# Altium schematic sheet SoC_PWR.SchDoc
size A3; SheetNumber: 3; SheetTotal: 6
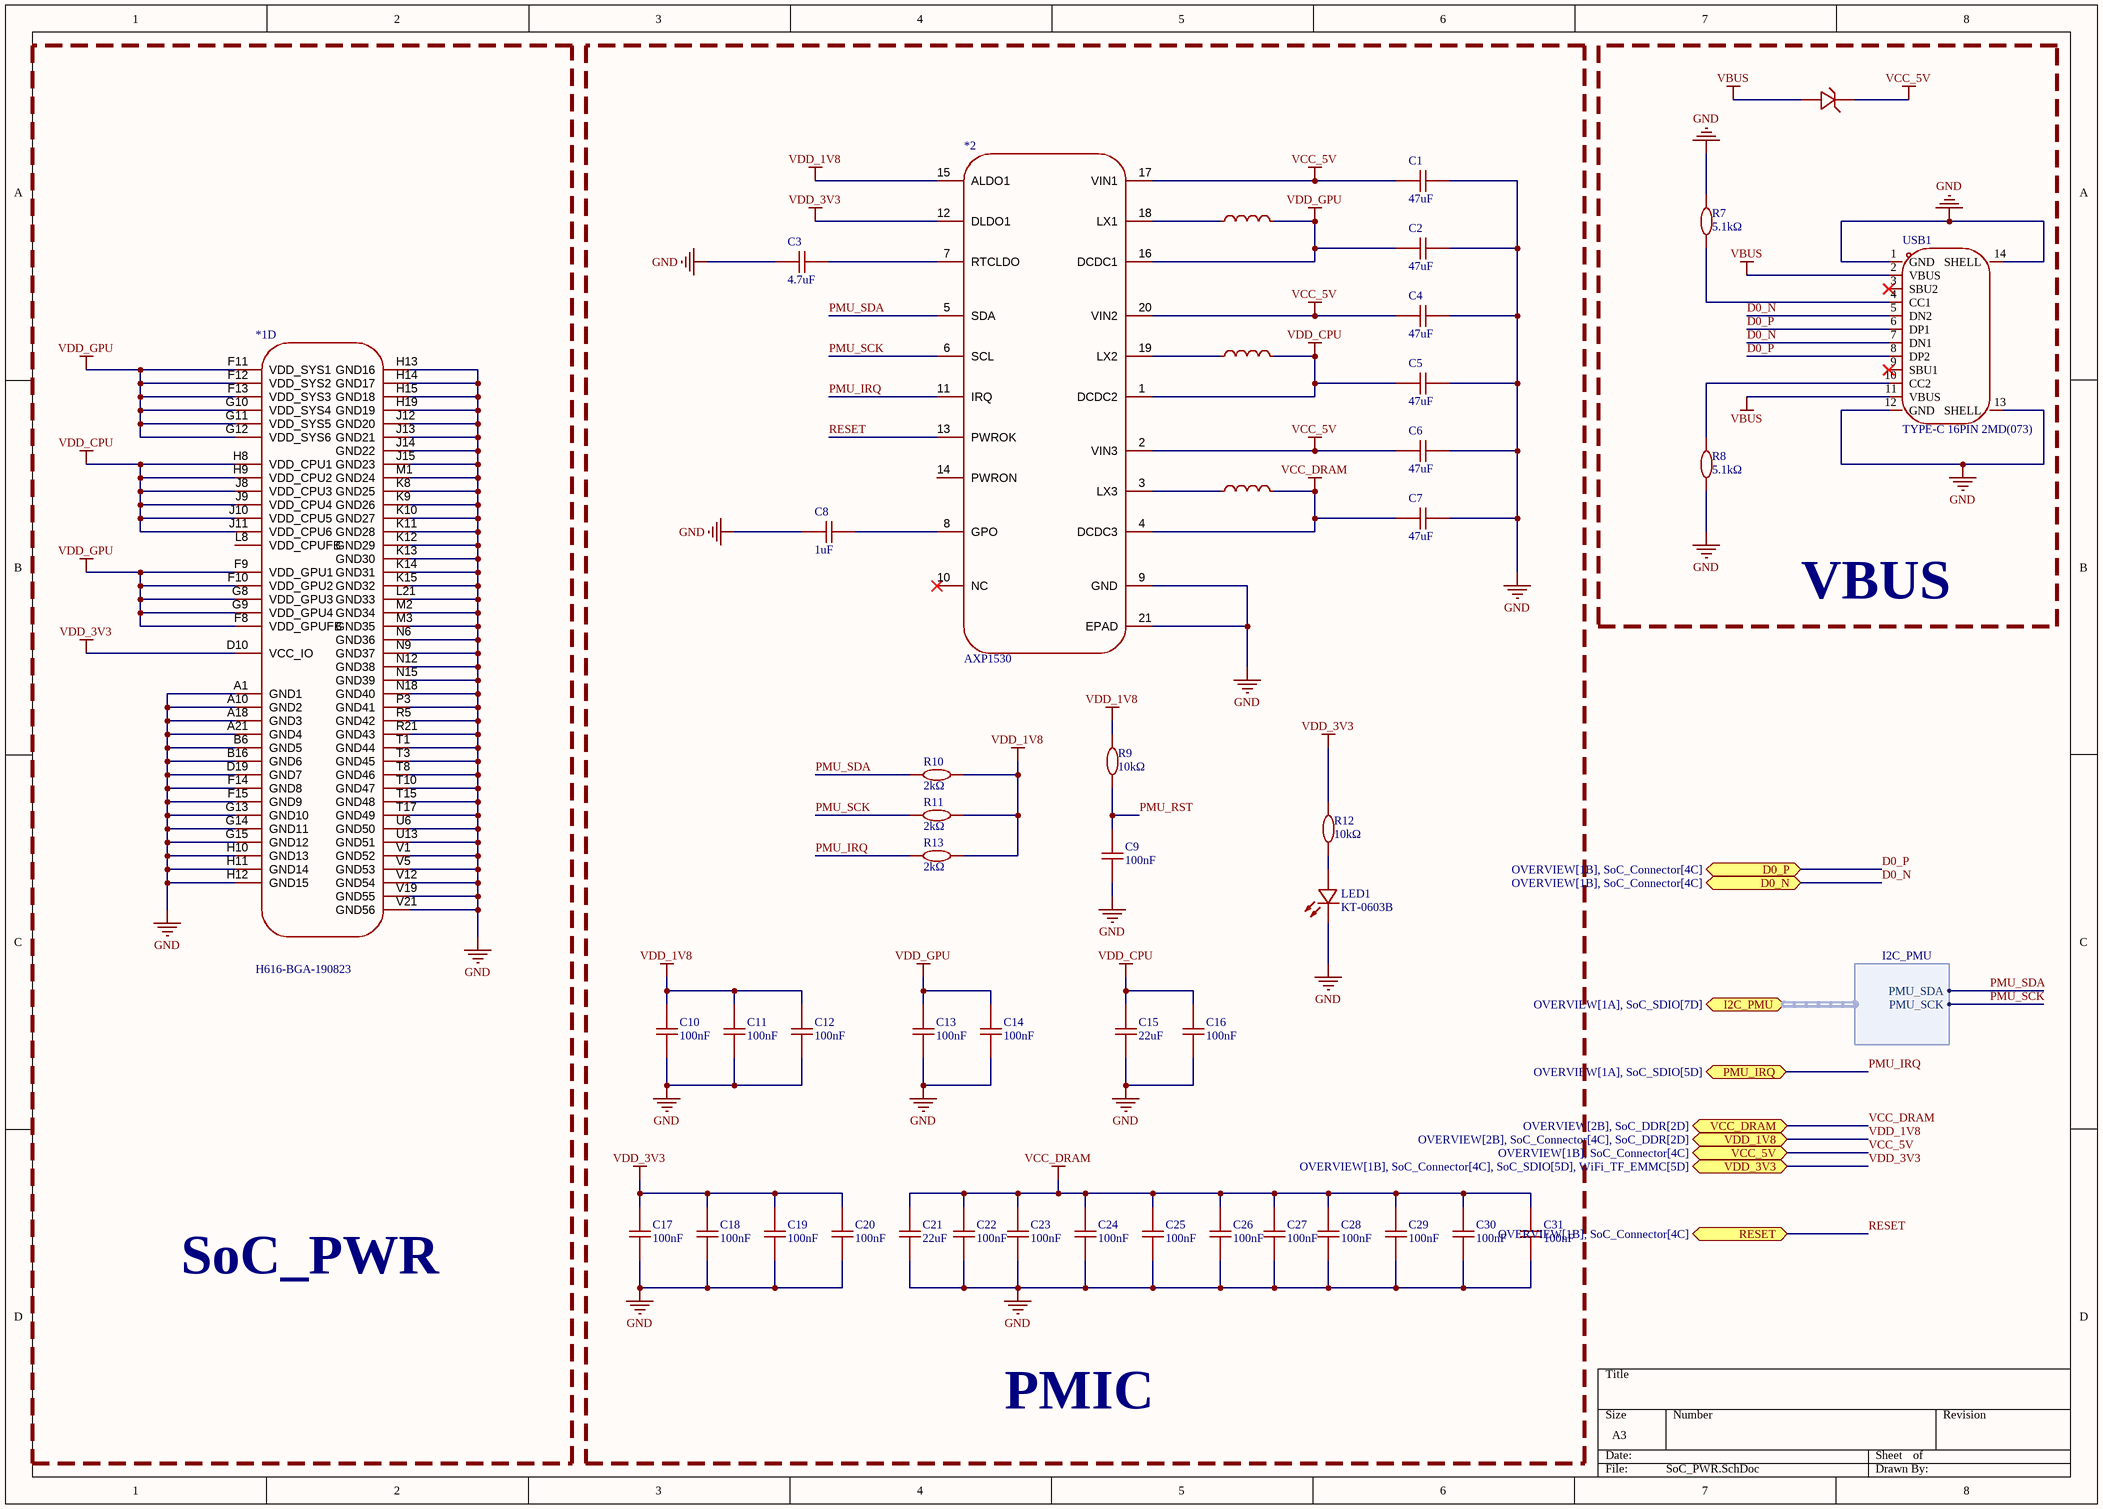
[diagram p0: SoC_PWR.SchDoc]

## Parts
*1  H616-BGA-190823  [BGA-284_L14.0-W12.0-P0.65-TL]  (part D of 4)
*2  AXP1530  [QFN-20_L3.0-W3.0-P0.40-BL-EP1.7]
C1  47uF  [C0603]
C2  47uF  [C0603]
C3  4.7uF  [C0402]
C4  47uF  [C0603]
C5  47uF  [C0603]
C6  47uF  [C0603]
C7  47uF  [C0603]
C8  1uF  [C0402]
C9  100nF  [C0402]
C10  100nF  [C0402]
C11  100nF  [C0402]
C12  100nF  [C0402]
C13  100nF  [C0402]
C14  100nF  [C0402]
C15  22uF  [C0603]
C16  100nF  [C0402]
C17  100nF  [C0402]
C18  100nF  [C0402]
C19  100nF  [C0402]
C20  100nF  [C0402]
C21  22uF  [C0603]
C22  100nF  [C0402]
C23  100nF  [C0402]
C24  100nF  [C0402]
C25  100nF  [C0402]
C26  100nF  [C0402]
C27  100nF  [C0402]
C28  100nF  [C0402]
C29  100nF  [C0402]
C30  100nF  [C0402]
C31  100nF  [C0402]
D1  DSK24  [SOD-123FL_L2.7-W1.8-LS3.8-RD]  (value not drawn)
L1  1uH  [IND-SMD_L4.0-W4.0]  (value not drawn)
L2  1uH  [IND-SMD_L4.0-W4.0]  (value not drawn)
L3  1uH  [IND-SMD_L4.0-W4.0]  (value not drawn)
LED1  KT-0603B  [LED0603-BL]
R7  5.1kΩ  [R0402]
R8  5.1kΩ  [R0402]
R9  10kΩ  [R0402]
R10  2kΩ  [R0402]
R11  2kΩ  [R0402]
R12  10kΩ  [R0402]
R13  2kΩ  [R0402]
USB1  TYPE-C 16PIN 2MD(073)  [USB-C-SMD_TYPE-C-6PIN-2MD-073]

## Blocks framed on the sheet
SoC_PWR: *1
PMIC: *2 C1-C31 L1-L3 LED1 R9-R13
VBUS: D1 R7 R8 USB1

## Ports
D0_N (bidir, see OVERVIEW[1B], SoC_Connector[4C]), D0_P (bidir, see OVERVIEW[1B], SoC_Connector[4C]), I2C_PMU (bidir, harness I2C_PMU, see OVERVIEW[1A], SoC_SDIO[7D]), PMU_IRQ (bidir, see OVERVIEW[1A], SoC_SDIO[5D]), RESET (bidir, see OVERVIEW[1B], SoC_Connector[4C]), VCC_5V (bidir, see OVERVIEW[1B], SoC_Connector[4C]), VCC_DRAM (bidir, see OVERVIEW[2B], SoC_DDR[2D]), VDD_1V8 (bidir, see OVERVIEW[2B], SoC_Connector[4C], SoC_DDR[2D]), VDD_3V3 (bidir, see OVERVIEW[1B], SoC_Connector[4C], SoC_SDIO[5D], WiFi_TF_EMMC[5D])

## Harnesses
I2C_PMU: PMU_SDA, PMU_SCK

## Nets
GND: *1.A1(GND1) *1.A10(GND2) *1.A18(GND3) *1.A21(GND4) *1.B6(GND5) *1.B16(GND6) *1.D19(GND7) *1.F14(GND8) *1.F15(GND9) *1.G13(GND10) *1.G14(GND11) *1.G15(GND12) *1.H10(GND13) *1.H11(GND14) *1.H12(GND15) *1.H13(GND16) *1.H14(GND17) *1.H15(GND18) *1.H19(GND19) *1.J12(GND20) *1.J13(GND21) *1.J14(GND22) *1.J15(GND23) *1.K8(GND25) *1.K9(GND26) *1.K10(GND27) *1.K11(GND28) *1.K12(GND29) *1.K13(GND30) *1.K14(GND31) *1.K15(GND32) *1.L21(GND33) *1.M1(GND24) *1.M2(GND34) *1.M3(GND35) *1.N6(GND36) *1.N9(GND37) *1.N12(GND38) *1.N15(GND39) *1.N18(GND40) *1.P3(GND41) *1.R5(GND42) *1.R21(GND43) *1.T1(GND44) *1.T3(GND45) *1.T8(GND46) *1.T10(GND47) *1.T15(GND48) *1.T17(GND49) *1.U6(GND50) *1.U13(GND51) *1.V1(GND52) *1.V5(GND53) *1.V12(GND54) *1.V19(GND55) *1.V21(GND56) *2.9(GND) *2.21(EPAD) C1.2 C2.2 C3.1 C4.2 C5.2 C6.2 C7.2 C8.1 C9.1 C10.1 C11.1 C12.1 C13.1 C14.1 C15.1 C16.1 C17.1 C18.1 C19.1 C20.1 C21.1 C22.1 C23.1 C24.1 C25.1 C26.1 C27.1 C28.1 C29.1 C30.1 C31.1 LED1.1(K) R7.2 R8.2 USB1.1(GND) USB1.12(GND) USB1.13(SHELL) USB1.14(SHELL)
VBUS: D1.2(A) USB1.2(VBUS) USB1.11(VBUS)
VCC_5V: *2.2(VIN3) *2.17(VIN1) *2.20(VIN2) C1.1 C4.1 C6.1 D1.1(C) ; port VCC_5V
VCC_DRAM: *2.4(DCDC3) C7.1 C21.2 C22.2 C23.2 C24.2 C25.2 C26.2 C27.2 C28.2 C29.2 C30.2 C31.2 L3.2 ; port VCC_DRAM
VDD_1V8: *2.15(ALDO1) C10.2 C11.2 C12.2 R9.2 R10.2 R11.2 R13.2 ; port VDD_1V8
VDD_3V3: *1.D10(VCC_IO) *2.12(DLDO1) C17.2 C18.2 C19.2 C20.2 R12.2 ; port VDD_3V3
VDD_CPU: *1.H8(VDD_CPU1) *1.H9(VDD_CPU2) *1.J8(VDD_CPU3) *1.J9(VDD_CPU4) *1.J10(VDD_CPU5) *1.J11(VDD_CPU6) *2.1(DCDC2) C5.1 C15.2 C16.2 L2.2
VDD_GPU: *1.F8(VDD_GPUFB) *1.F9(VDD_GPU1) *1.F10(VDD_GPU2) *1.F11(VDD_SYS1) *1.F12(VDD_SYS2) *1.F13(VDD_SYS3) *1.G8(VDD_GPU3) *1.G9(VDD_GPU4) *1.G10(VDD_SYS4) *1.G11(VDD_SYS5) *1.G12(VDD_SYS6) *2.16(DCDC1) C2.1 C13.2 C14.2 L1.2
D0_N: USB1.5(DN2) USB1.7(DN1) ; port D0_N
D0_P: USB1.6(DP1) USB1.8(DP2) ; port D0_P
PMU_IRQ: *2.11(IRQ) R13.1 ; port PMU_IRQ
PMU_RST: C9.2 R9.1
PMU_SCK: *2.6(SCL) R11.1 ; port I2C_PMU.PMU_SCK
PMU_SDA: *2.5(SDA) R10.1 ; port I2C_PMU.PMU_SDA
RESET: *2.13(PWROK) ; port RESET
Net*2_3: *2.3(LX3) L3.1
Net*2_7: *2.7(RTCLDO) C3.2
Net*2_8: *2.8(GPO) C8.2
Net*2_18: *2.18(LX1) L1.1
Net*2_19: *2.19(LX2) L2.1
NetLED1_2: LED1.2(A) R12.1
NetR7_1: R7.1 USB1.4(CC1)
NetR8_1: R8.1 USB1.10(CC2)

Not connected (* = marked no-connect by the designer): *1 L8(VDD_CPUFB); *2 10(NC)* 14(PWRON); USB1 3(SBU2)* 9(SBU1)*

## Library data of the parts
*1 = H616-BGA-190823: Allwinner H616; Symbol: H616-BGA-190823
*2 = AXP1530: AXP313A; Symbol: AXP1530
C1 C2 C4-C7 = 47uF: 16V 22uF X5R ±20% 0603 Ceramic Capacitors ROHS
C3 = 4.7uF: 10V 4.7uF X5R ±20% 0402 Ceramic Capacitors ROHS
C8 = 1uF: 50V 1uF X5R ±10% 0402 Ceramic Capacitors ROHS
C9-C14 C16-C20 C22-C31 = 100nF: 50V 100nF X7R ±10% 0402 Ceramic Capacitors ROHS
C15 C21 = 22uF: 16V 22uF X5R ±20% 0603 Ceramic Capacitors ROHS
D1 = DSK24: 电压:40V 电流:2A; Manufacturer: Littelfuse(美国力特); Manufacturer Part: SMAJ5.0A; Symbol: SMAJ5.0A-C83329; Device: SMAJ5.0A_C83329; Add into BOM: yes; Polarity: Unidirectional; Reverse Stand-Off Voltage (Vrwm): 5V; Clamping Voltage: 9.2V; Peak Pulse Current (Ipp): 43.5A; Peak Pulse Power Dissipation (Ppp): 400W; Voltage - Breakdown: 6.4V; Reverse Leakage Current (Ir): 800uA; Type: TVS; LCSC Part Name: 耐压/V 5V-440V 峰值脉冲功率 400W; Supplier Part: C83329; Supplier Footprint: DO-214AC(SMA); JLCPCB Part Class: Extended Part; Datasheet: https://item.szlcsc.com/datasheet/SMAJ5.0A/84493.html; Supplier: LCSC; Convert to PCB: yes; Operating Temperature: -65℃~+150℃
L1-L3 = SLW4030S1R0NST: 4.15A 1uH ±30% 18mΩ SMD,4x4mm Fixed Inductors ROHS; Manufacturer: Sunltech(顺磁); Add into BOM: yes; Symbol: SLW4030S1R0NST; Device: SLW4030S1R0NST; LCSC Part Name: 1uH ±30%; Supplier Part: C206354; Manufacturer Part: SLW4030S1R0NST; Supplier Footprint: SMD,4x4mm; JLCPCB Part Class: Extended Part; Datasheet: https://item.szlcsc.com/datasheet/SLW4030S1R0NST/207399.html; Supplier: LCSC; Convert to PCB: yes; Value: 1uH; Tolerance: ±30%; Current Rating: 4.15A; DC Resistance(DCR): 18mΩ
LED1 = KT-0603B: 30mA 2.6V~3.2V Blue 0603 LED Indication - Discrete ROHS
R7 R8 = 5.1kΩ: 5.1kΩ 62.5mW 50V ±100ppm/℃ Thick Film Resistor ±1% 0402 Chip Resistor - Surface Mount ROHS
R9 R12 = 10kΩ: 62.5mW 10kΩ 50V ±100ppm/℃ Thick Film Resistor ±1% 0402 Chip Resistor - Surface Mount ROHS
R10 R11 R13 = 2kΩ: 100mW 2kΩ 75V ±100ppm/℃ Thick Film Resistor ±1% 0402 Chip Resistor - Surface Mount ROHS
USB1 = TYPE-C 16PIN 2MD(073): 16pin type-c